# Altium project R100.230.080.000-00 MeasOutUI.PrjPcb
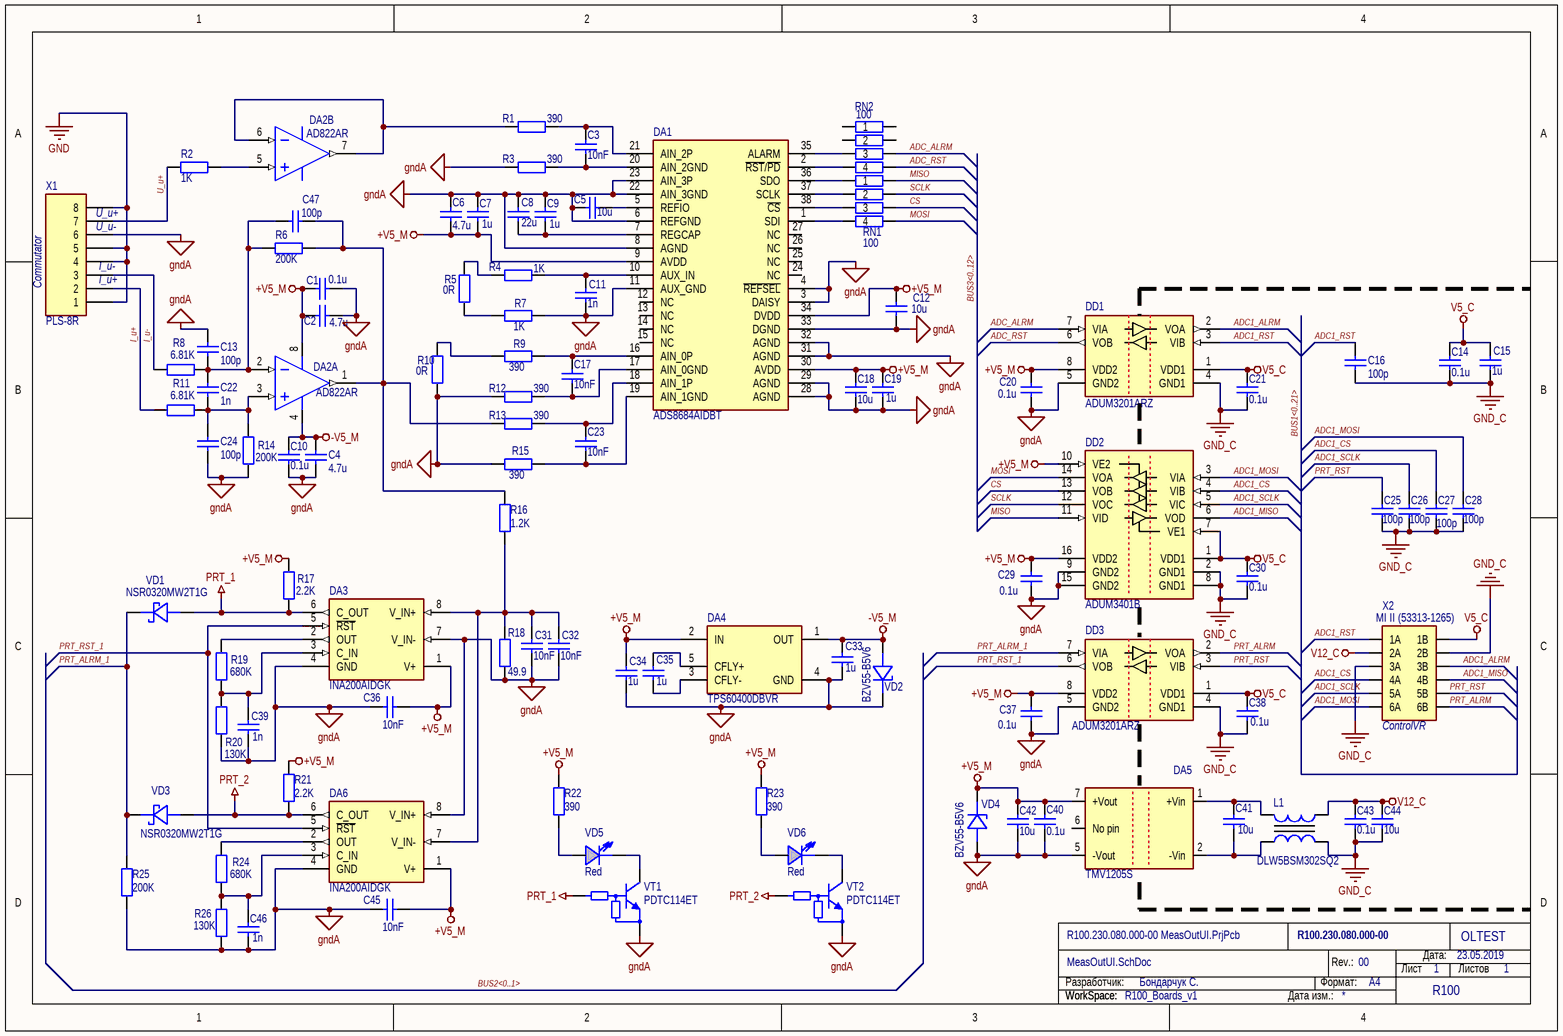
[diagram p0: MeasOutUI.SchDoc]
1 sheet, 95 parts. Net scope: global (net labels, ports and power ports of the same name join across sheets).
Board file: R100.230.080.001-00 MeasOutUI.PcbDoc

## Sheet MeasOutUI.SchDoc
size A4; Organization: OLTEST; Revision: 00; SheetNumber: 1; SheetTotal: 1; Название листа: Название листа; Файл: MeasOutUI; Разработчик: Бондарчук С.; Прибор: R100; АМАК.000000.000 Э3: R100.230.080.000-00; Дата: 23.05.2019; Формат: A4; WorkSpaceName: R100_Boards_v1

### Parts
C1  0.1u  [SMD_C_0603]
C2  4.7u  [SMD_C_0805]
C3  10nF  [SMD_C_0603]
C4  4.7u  [SMD_C_0805]
C5  10u  [SMD_C_1206]
C6  4.7u  [SMD_C_0805]
C7  1u  [SMD_C_0603]
C8  22u  [SMD_C_1210]
C9  1u  [SMD_C_0603]
C10  0.1u  [SMD_C_0603]
C11  1n  [SMD_C_0603]
C12  10u  [SMD_C_1206]
C13  100p  [SMD_C_0603]
C14  0.1u  [SMD_C_0603]
C15  1u  [SMD_C_0603]
C16  100p  [SMD_C_0603]
C17  10nF  [SMD_C_0603]
C18  10u  [SMD_C_1206]
C19  1u  [SMD_C_0603]
C20  0.1u  [SMD_C_0603]
C21  0.1u  [SMD_C_0603]
C22  1n  [SMD_C_0603]
C23  10nF  [SMD_C_0603]
C24  100p  [SMD_C_0603]
C25  100p  [SMD_C_0603]
C26  100p  [SMD_C_0603]
C27  100p  [SMD_C_0603]
C28  100p  [SMD_C_0603]
C29  0.1u  [SMD_C_0603]
C30  0.1u  [SMD_C_0603]
C31  10nF  [SMD_C_0805]
C32  10nF  [SMD_C_0805]
C33  1u  [SMD_C_0603]
C34  1u  [SMD_C_0603]
C35  1u  [SMD_C_0603]
C36  10nF  [SMD_C_0603]
C37  0.1u  [SMD_C_0603]
C38  0.1u  [SMD_C_0603]
C39  1n  [SMD_C_0603]
C40  0.1u  [SMD_C_0603]
C41  10u  [SMD_C_1206]
C42  10u  [SMD_C_1206]
C43  0.1u  [SMD_C_0603]
C44  10u  [SMD_C_1206]
C45  10nF  [SMD_C_0603]
C46  1n  [SMD_C_0603]
C47  100p  [SMD_C_0603]
DA1  ADS8684AIDBT  [TSSOP38]
DA2  AD822AR  [SOIC-8]  (parts A,B of 2)
DA3  INA200AIDGK  [TSOP-8 65P490X110]
DA4  TPS60400DBVR  [TI-DBV5_M]
DA5  TMV1205S  [SIP7]
DA6  INA200AIDGK  [TSOP-8 65P490X110]
DD1  ADUM3201ARZ  [SOIC-8]
DD2  ADUM3401B  [ADI-RW-16_N]
DD3  ADUM3201ARZ  [SOIC-8]
L1  DLW5BSM302SQ2  [DLW5BS(AH)]
R1  390  [SMD_R_0805]
R2  1K  [SMD_R_0805]
R3  390  [SMD_R_0805]
R4  1K  [SMD_R_0603]
R5  0R  [SMD_R_0603]
R6  200K  [SMD_R_0805]
R7  1K  [SMD_R_0603]
R8  6.81K  [SMD_R_1206]
R9  390  [SMD_R_0805]
R10  0R  [SMD_R_0603]
R11  6.81K  [SMD_R_1206]
R12  390  [SMD_R_0805]
R13  390  [SMD_R_0805]
R14  200K  [SMD_R_0805]
R15  390  [SMD_R_0805]
R16  1.2K  [SMD_R_0805]
R17  2.2K  [SMD_R_0805]
R18  49.9  [SMD_R_0805]
R19  680K  [SMD_R_0805]
R20  130K  [SMD_R_0805]
R21  2.2K  [SMD_R_0805]
R22  390  [SMD_R_0805]
R23  390  [SMD_R_0805]
R24  680K  [SMD_R_0805]
R25  200K  [SMD_R_0805]
R26  130K  [SMD_R_0805]
RN1  100  [CRA06S]
RN2  100  [CRA06S]
VD1  NSR0320MW2T1G  [SOD 2 FL250X100]
VD2  BZV55-B5V6  [SOD80C]
VD3  NSR0320MW2T1G  [SOD 2 FL250X100]
VD4  BZV55-B5V6  [SOD80C]
VD5  value Red  [SMD_LED_LL_Red]  (hidden comment: LL-S172SC-2S)
VD6  value Red  [SMD_LED_LL_Red]  (hidden comment: LL-S172SC-2S)
VT1  PDTC114ET  [SOT23-3]
VT2  PDTC114ET  [SOT23-3]
X1  PLS-8R  [PLS_R-1x8 (22-28-9080 mplex)]
X2  MI II (53313-1265)  [53313-1265]

### Nets
+V5_M: C1.2 C2.1 C6.1 C7.1 C12.2 C18.2 C19.2 C20.2 C29.2 C34.2 C36.2 C37.2 C40.2 C42.2 C45.2 DA1.9(AVDD) DA1.30(AVDD) DA1.34(DVDD) DA2.8(V+) DA3.1(V+) DA4.2(IN) DA5.7(+Vout) DA6.1(V+) DD1.8(VDD2) DD2.10(VE2) DD2.16(VDD2) DD3.8(VDD2) R17.2 R21.2 R22.2 R23.2 VD4.2(CATHODE)
-V5_M: C4.2 C10.1 C33.2 DA2.4(V-) DA4.1(OUT) VD2.1(ANODE)
GND: X1.1 X1.4 X1.5 X1.8
GND_C: C14.1 C15.1 C16.1 C21.1 C25.1 C26.1 C27.1 C28.1 C30.1 C38.1 C43.1 C44.1 DD1.4(GND1) DD2.2(GND1) DD2.8(GND1) DD3.4(GND1) L1.2 X2.2B X2.3A
gndA: C1.1 C2.2 C4.1 C5.2 C6.2 C7.2 C8.2 C9.2 C10.2 C11.1 C12.1 C13.1 C18.1 C19.1 C20.1 C24.2 C29.1 C31.1 C32.1 C33.1 C34.1 C36.1 C37.1 C39.1 C40.1 C42.1 C45.1 C46.1 DA1.3(DAISY) DA1.4(~{REFSEL}) DA1.6(REFGND) DA1.8(AGND) DA1.11(AUX_GND) DA1.22(AIN_3GND) DA1.23(AIN_3P) DA1.28(AGND) DA1.29(AGND) DA1.31(AGND) DA1.32(AGND) DA1.33(DGND) DA3.4(GND) DA3.7(V_IN-) DA4.4(GND) DA5.5(-Vout) DA6.4(GND) DA6.8(V_IN+) DD1.5(GND2) DD2.9(GND2) DD2.15(GND2) DD3.5(GND2) R3.1 R7.2 R10.1 R12.1 R14.1 R15.1 R18.1 R20.1 R25.1 R26.1 VD2.2(CATHODE) VD4.1(ANODE) VT1.2(E) VT2.2(E) X1.6
PRT_1: DA3.6(C_OUT) R17.1 VD1.2(ANODE) VT1.1(B)
PRT_2: DA6.6(C_OUT) R21.1 VD3.2(ANODE) VT2.1(B)
V5_C: C14.2 C15.2 C21.2 C30.2 C38.2 DD1.1(VDD1) DD2.1(VDD1) DD2.7(VE1) DD3.1(VDD1) X2.1B
V12_C: C43.2 C44.2 L1.3 X2.2A
ADC1_ALRM: DD1.2(VOA) X2.3B
ADC1_CS: C27.2 DD2.4(VIB) X2.4A
ADC1_MISO: DD2.6(VOD) X2.4B
ADC1_MOSI: C28.2 DD2.3(VIA) X2.6A
ADC1_RST: C16.2 DD1.3(VIB) X2.1A
ADC1_SCLK: C26.2 DD2.5(VIC) X2.5A
ADC_ALRM: DD1.7(VIA) RN2.6
ADC_RST: DD1.6(VOB) RN2.5
CS: DD2.13(VOB) RN1.6
I_u+: R11.1 X1.2
I_u-: R8.1 X1.3
MISO: DD2.11(VID) RN1.8
MOSI: DD2.14(VOA) RN1.5
PRT_ALRM: DD3.2(VOA) X2.6B
PRT_ALRM_1: DD3.7(VIA) R25.2 VD1.1(CATHODE) VD3.1(CATHODE)
PRT_RST: C25.2 DD3.3(VIB) X2.5B
PRT_RST_1: DA3.5(~{RS}~{T}) DA6.5(~{RS}~{T}) DD3.6(VOB)
SCLK: DD2.12(VOC) RN1.7
U_u+: R2.1 X1.7
NetC3_1: C3.1 DA1.20(AIN_2GND) R3.2
NetC3_2: C3.2 DA1.21(AIN_2P) R1.2
NetC5_1: C5.1 DA1.5(REFIO)
NetC8_1: C8.1 C9.1 DA1.7(REGCAP)
NetC11_2: C11.2 DA1.10(AUX_IN) R4.2
NetC13_2: C13.2 C22.2 C47.1 DA2.2(IN_A-) R6.1 R8.2
NetC17_1: C17.1 DA1.17(AIN_0GND) R12.2
NetC17_2: C17.2 DA1.16(AIN_0P) R9.2
NetC22_1: C22.1 C24.1 DA2.3(IN_A+) R11.2 R14.2
NetC23_1: C23.1 DA1.19(AIN_1GND) R15.2
NetC23_2: C23.2 DA1.18(AIN_1P) R13.2
NetC31_2: C31.2 C32.2 DA3.8(V_IN+) DA6.7(V_IN-) R16.1 R18.2
NetC35_1: C35.1 DA4.3(CFLY-)
NetC35_2: C35.2 DA4.5(CFLY+)
NetC39_2: C39.2 DA3.3(C_IN) R19.1 R20.2
NetC41_1: C41.1 DA5.2(-Vin) L1.1
NetC41_2: C41.2 DA5.1(+Vin) L1.4
NetC46_2: C46.2 DA6.3(C_IN) R24.2 R26.2
NetC47_2: C47.2 DA2.1(OUT_A) R6.2 R13.1 R16.2
NetDA1_1: DA1.1(SDI) RN1.4
NetDA1_2: DA1.2(~{RST}/~{PD}) RN2.4
NetDA1_35: DA1.35(ALARM) RN2.3
NetDA1_36: DA1.36(SDO) RN1.1
NetDA1_37: DA1.37(SCLK) RN1.2
NetDA1_38: DA1.38(~{CS}) RN1.3
NetDA2_5: DA2.5(IN_B+) R2.2
NetDA2_6: DA2.6(IN_B-) DA2.7(OUT_B) R1.1
NetDA3_2: DA3.2(OUT) R19.2
NetDA6_2: DA6.2(OUT) R24.1
NetR4_1: R4.1 R5.2
NetR5_1: R5.1 R7.1
NetR9_1: R9.1 R10.2
NetR22_1: R22.1 VD5.1(ANODE)
NetR23_1: R23.1 VD6.1(ANODE)
NetVD5_2: VD5.2(CATHODE) VT1.3(C)
NetVD6_2: VD6.2(CATHODE) VT2.3(C)

Not connected (* = marked no-connect by the designer): DA1 12(NC) 13(NC) 14(NC) 15(NC) 24(NC) 25(NC) 26(NC) 27(NC); DA5 6(No_pin); RN2 1 2 7 8

### Buses and harness runs
bus BUS1<0..21>
bus BUS2<0..1>
bus BUS3<0..12>

### Notes on the sheet
- (near X1) U_u-
- (near X1) U_u+
- (near X1) Commutator
- (near X1) I_u+
- (near X1) I_u-
- (near X2) ControlVR
- Разработчик:
- Формат:
- Rev.:
- Лист
- Дата:
- Листов
- WorkSpace:
- Дата изм.:

### Library data of the parts
C1 C10 C14 C20 C21 C29 C30 C37 C38 C40 C43 = C0603 0.1u 50V 10%: SMD C 0603 MURATA 50V 10% X7R; PartNumber: GRM188R71H104K; Manufacturer: MURATA; Value: 0.1u
C2 C4 C6 = C0805 4.7u 25V 20%  X5R: SMD C 0805 MURATA 50V 5% NP0; PartNumber: GRM21BR61E475M; Manufacturer: MURATA; Value: 4.7u
C3 C17 C23 C36 C45 = C0603 10nF 100V 10%: SMD C 0603 MURATA 100V 10% X7R; PartNumber: GRJ188R72A103KE11#; Manufacturer: MURATA; Value: 10nF
C5 C12 C18 C41 C42 C44 = C1206 10u 25V 20%: SMD C 1206 MURATA 25V 20% X5R; PartNumber: GRM31MR61E106M; Manufacturer: MURATA; Value: 10u
C7 C9 C15 C19 C33-C35 = C0603 1uF 25V 10%: SMD C 0603 MURATA 25V 10% X7R; PartNumber: GRM188R71E105KA12; Manufacturer: MURATA; Value: 1u
C8 = C1210 22u 25V 10%: SMD C 1210 MURATA 22uF 25V 10%  X7R; PartNumber: GRM32ER71E226K; Manufacturer: MURATA; Value: 22u
C11 C22 C39 C46 = C0603 1n 50V 5%: SMD C 0603 MURATA 50V 5% NP0; PartNumber: GRM1885C1H102JA01; Manufacturer: MURATA; Value: 1n
C13 C16 C24-C28 C47 = C0603 100p 100V 5%: SMD C 0603 MURATA 100V 5% NP0; PartNumber: GRM1885C2A101JA01; Manufacturer: MURATA; Value: 100p
C31 C32 = C0805 10n 100V 20%: SMD C 0805 MURATA 100V 20% X7R; PartNumber: GRM216R72A103MAC4#; Manufacturer: MURATA; Value: 10nF
DA1 = ADS8684AIDBT: 16-bit 500ksps ADC with MUX; Manufacturer: Texas Instruments; PartNumber: ADS8684AIDBT
DA2 = AD822AR: 2xOp Ampl Rail FET 30V; Manufacturer: Analog Devices; PartNumber: AD822AR
DA3 DA6 = INA200AIDGK: Current-Shunt Monitor Ref G=20; Manufacturer: Texas Instruments; PartNumber: INA200AIDGK
DA4 = TPS60400DBVR: -1.8 to -5.25 V, Inverting Charge Pump, 60 mA, 1.8 to 5.25 V Input with 2-Cell Alkaline / Nixx Input, -40 to 85 degC, 5-pin SOT23 (DBV5), Green (RoHS & no Sb/Br); Manufacturer: Texas Instruments; 2-Cell Alkaline/Nixx Input: TRUE; Efficiency(Typ)(%): 99; Iout(Max)(A): 0.06; Iq(Typ)(mA): 0.125; Switching Frequency(Max)(kHz): 450; Topology: Inverting Buck/Boost; Vin(Max)(V): 5.25; Vin(Min)(V): 1.8; Vout(Min)(V): -1.6; DatasheetVersion: SLVS324A; PackageVersion: 4073253-4/K; PackageReference: DBV5; PackageDescription: 5-Pin Plastic Small Outline, Body 1.60 Г— 2.90 mm, Pitch 0.95 mm; Eco-Plan: Green (RoHS & no Sb/Br); Vout(Max)(V): -5.25; Mounting Technology: Surface Mount; Code_JEDEC: MO-178; PartNumber: TPS60400DBVR; ComponentLink1Description: Manufacturer URL; ComponentLink1URL: http://www.ti.com/; ComponentLink2Description: Datasheet; ComponentLink2URL: http://www.ti.com/general/docs/lit/getliterature.tsp?genericPartNumber=TPS60400&fileType=pdf; ComponentLink3Description: Package Specification; ComponentLink3URL: http://www.ti.com/litv/pdf/mpds018i
DA5 = TMV1205S: DC/DC; Manufacturer: TRACO POWER; PartNumber: TMV1205S
DD1 DD3 = ADUM3201ARZ: Dual Channel Digital Isolator, Enhanced System-Level ESD Reliability, 2.5 KV rms Insulation Rating, 1 Mbps Data Rate, 150 ns Delay, Industrial, 8-pin SOIC (R-8), Tube; Manufacturer: Analog Devices; PartNumber: ADUM3201ARZ
DD2 = ADUM3401BRWZ: Quad Channel Digital Isolator, Enhanced System-Level ESD Reliability, 2.5 KV rms Insulation Rating, 10 Mbps Data Rate, 50 ns Delay, Industrial, 16-pin SOIC (RW-16), Tube; Manufacturer: Analog Devices; Insulation Rating (kVrms): 2.5; Max Data Rate: 10Mbps; DatasheetVersion: Rev. B; PackageVersion: 032707-B, 03/2007; PackageReference: RW-16; PackageDescription: 16-Pin Standard Small Outline Package, Body 10.3 x 7.5 mm, Pitch 1.27 mm; Max Operating Temp (degreesC): 105; Mounting Technology: Surface Mount; Code_JEDEC: MS-013-AA; PartNumber: ADUM3401BRWZ; ComponentLink1Description: Manufacturer URL; ComponentLink1URL: http://www.analog.com/en/index.html; ComponentLink2Description: Datasheet; ComponentLink2URL: http://www.analog.com/static/imported-files/data_sheets/ADUM3400_3401_3402.pdf; ComponentLink3Description: Package Specification; ComponentLink3URL: http://www.analog.com/static/imported-files/packages/PKG_PDF/SOIC_WIDE%20%28RW%29/RW_16.pdf; ComponentLink4Description: URL Link1; ComponentLink4URL: Product URL:http://www.analog.com/en/interface-isolation/digital-isolators/adum3401/products/product.html
L1 = DLW5BSM302SQ2: SMD Common Mode Choke Coil 0.5A Z = 3000 Ohm / 100 MHz; Manufacturer: MURATA; PartNumber: DLW5BSM302SQ2
R1 R3 R9 R12 R13 R15 R22 R23 = R0805 390R +-1%: SMD R 0805 VISHAY 0.125W 150V 1% 100ppm; PartNumber: CRCW0805390RFK; Manufacturer: VISHAY; Value: 390
R2 = R0805 1K 1%: SMD R 0805 VISHAY 0.125W 150V 1% 100ppm; PartNumber: CRCW08051K00FK; Manufacturer: VISHAY; Value: 1K
R4 R7 = R0603 1K 1%: SMD R 0603 VISHAY 0.1W 75V 1% 100ppm; PartNumber: CRCW06031K00FK; Manufacturer: VISHAY; Value: 1K
R5 R10 = R0603 0R 1%: SMD R 0603 VISHAY 0.1W 75V 1% 100ppm; PartNumber: CRCW06030000Z0; Manufacturer: VISHAY; Value: 0R
R6 R14 R25 = R0805 200K 1%: SMD R 0805 VISHAY 0.125W 150V 1% 100ppm; PartNumber: CRCW0805200KFK; Manufacturer: VISHAY; Value: 200K
R8 R11 = R1206 6.81K 1%: SMD R 1206 VISHAY 0.25W 150V 1% 100ppm; PartNumber: CRCW12066K81FK; Manufacturer: VISHAY; Value: 6.81K
R16 = R0805 1.2K 1%: SMD R 0805 VISHAY 0.125W 150V 1% 100ppm; PartNumber: CRCW08051K2FK; Manufacturer: VISHAY; Value: 1.2K
R17 R21 = R0805 2.2K 1%: SMD R 0805 VISHAY 0.125W 150V 1% 100ppm; PartNumber: CRCW08052K20FK; Manufacturer: VISHAY; Value: 2.2K
R18 = R0805 49.9 1%: SMD R 0805 VISHAY 0.125W 150V 1% 100ppm; PartNumber: CRCW080549R9FK; Manufacturer: VISHAY; Value: 49.9
R19 R24 = R0805 680K 1%: SMD R 0805 VISHAY 0.125W 150V 1% 100ppm; PartNumber: CRCW0805680KFK; Manufacturer: VISHAY; Value: 680K
R20 R26 = R0805 130K 1%: SMD R 0805 VISHAY 0.125W 150V 1% 100ppm; PartNumber: CRCW0805130KFK; Manufacturer: VISHAY; Value: 130K
RN1 RN2 = CRA06S 4x100 1%: SMD RESISTOR ARRAY VISHAY 0.063W 50V 1% 100ppm; PartNumber: CRA06S083100RF; Manufacturer: VISHAY; Value: 100
VD1 VD3 = NSR0320MW2T1G: Vr=20V If=1A Schottky Diode; Manufacturer: ON SEMICONDUCTOR; PartNumber: NSR0320MW2T1G
VD2 VD4 = BZV55-B5V6: 0.5W Vz=5.6V +-2%; Manufacturer: NXP; PartNumber: BZV55-B5V6
VD5 VD6 = LL-S172SC-2S: LED Red SMD; Manufacturer: Lucky Light; PartNumber: LL-S172SC-2S
VT1 VT2 = PDTC114ET: Digital Transistor (BRT), R1=10 kOhm, R2=10 kOhm, NPN Transistor; Manufacturer: On Semiconductor; PartNumber: PDTC114ET
X1 = PLS-8R (22-28-9080): Molex KK254 42377 LS=2.54 4A 250VDC PCB; PartNumber: 22-28-9080; Manufacturer: MOLEX
X2 = 53313-1265: MI II 12 (6x2row), 2A 125V 2mm; Manufacturer: MOLEX; PartNumber: 53313-1265